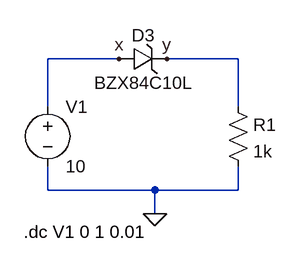
[diagram p0: schematic Zener diode forward biased.asc]
Zener diode forward biased.asc, the LTspice schematic file:
Version 4
SHEET 1 880 680
WIRE 224 48 128 48
WIRE 384 48 288 48
WIRE 128 112 128 48
WIRE 384 112 384 48
WIRE 128 224 128 192
WIRE 272 224 128 224
WIRE 384 224 384 192
WIRE 384 224 272 224
WIRE 272 256 272 224
FLAG 272 256 0
FLAG 224 48 x
FLAG 288 48 y
SYMBOL voltage 128 96 R0
WINDOW 123 0 0 Left 0
WINDOW 39 0 0 Left 0
SYMATTR InstName V1
SYMATTR Value 10
SYMBOL res 368 96 R0
SYMATTR InstName R1
SYMATTR Value 1k
SYMBOL zener 224 64 R270
WINDOW 0 32 32 VTop 2
WINDOW 3 0 32 VBottom 2
SYMATTR InstName D3
SYMATTR Value BZX84C10L
SYMATTR Description Diode
SYMATTR Type diode
TEXT 96 280 Left 2 !.dc V1 0 1 0.01

The netlist it stands for:
* Zener diode forward biased.asc
V1 x 0 10
R1 y 0 1k
D3 x y BZX84C10L
.model D D
.lib standard.dio
.dc V1 0 1 0.01
.backanno
.end